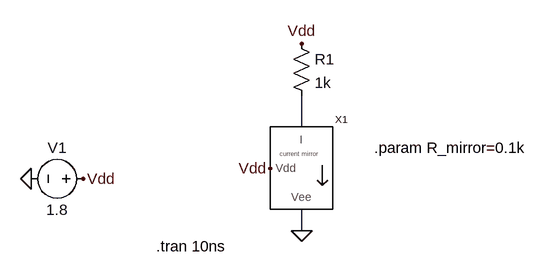
[diagram p0: schematic current_mirror_sim.asc]
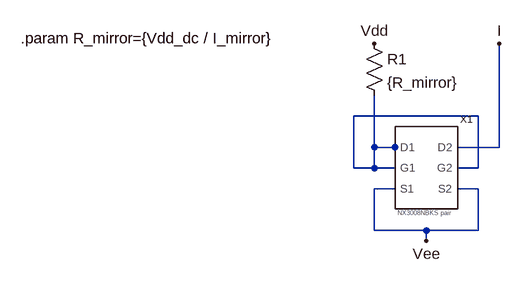
[diagram p1: sub-circuit current_mirror.asc]
current_mirror_sim.asc, the LTspice schematic file:
Version 4.1
SHEET 1 880 680
WIRE 192 64 192 16
WIRE 192 224 192 192
FLAG 192 224 0
FLAG 144 128 Vdd
FLAG 192 -64 Vdd
FLAG -224 144 0
FLAG -144 144 Vdd
SYMBOL current_mirror 192 96 R0
SYMATTR InstName X1
SYMBOL res 176 -80 R0
SYMATTR InstName R1
SYMATTR Value 1k
SYMBOL voltage -128 144 R90
WINDOW 0 -32 56 VBottom 2
WINDOW 3 32 56 VTop 2
WINDOW 123 0 0 Left 0
WINDOW 39 0 0 Left 0
SYMATTR InstName V1
SYMATTR Value 1.8
TEXT 304 96 Left 2 !.param R_mirror=0.1k
TEXT -32 248 Left 2 !.tran 10ns

current_mirror.asc, the sub-circuit schematic file:
Version 4.1
SHEET 1 1140 680
WIRE 288 96 96 96
WIRE 128 144 128 64
WIRE 160 144 160 128
WIRE 160 144 128 144
WIRE 320 144 320 -16
WIRE 320 144 256 144
WIRE 96 176 96 96
WIRE 128 176 128 144
WIRE 128 176 96 176
WIRE 160 176 128 176
WIRE 288 176 288 96
WIRE 288 176 256 176
WIRE 160 208 128 208
WIRE 288 208 256 208
WIRE 128 272 128 208
WIRE 208 272 128 272
WIRE 288 272 288 208
WIRE 288 272 208 272
WIRE 208 288 208 272
FLAG 320 -16 I
FLAG 208 288 Vee
FLAG 128 -16 Vdd
SYMBOL res 112 -32 R0
SYMATTR InstName R1
SYMATTR Value {R_mirror}
SYMBOL NX3008NBKS_pair 224 176 R0
SYMATTR InstName X1
TEXT -416 -24 Left 2 !.param R_mirror={Vdd_dc / I_mirror}

The netlist it stands for:
* current_mirror_sim.asc
X§X1 Vdd 0 N001 current_mirror
R1 Vdd N001 1k
V1 Vdd 0 1.8

* block symbol definitions
.subckt current_mirror Vdd Vee I
R1 Vdd N001 {R_mirror}
X§X1 N001 N001 Vee I N001 Vee NX3008NBKS_pair  ; pins D1 G1 S1 D2 G2 S2
.param R_mirror={Vdd_dc / I_mirror}
.ends current_mirror

.param R_mirror=0.1k
.tran 10ns
.backanno
.end